# Altium project Ovladaci_karta.PrjPcb (part 2 of 2)

## Sheet PORT_SINGLE.SchDoc
size A4; SheetNumber: 8; SheetTotal: 8
Used 3 times, as channels U_PORTS_DRIVER/U_PORT_SINGLE, U_PORTS_DRIVER/U_PORT_SINGLE, U_PORTS_DRIVER/U_PORT_SINGLE. Parts and nets are listed once, with the designators drawn on the sheet.
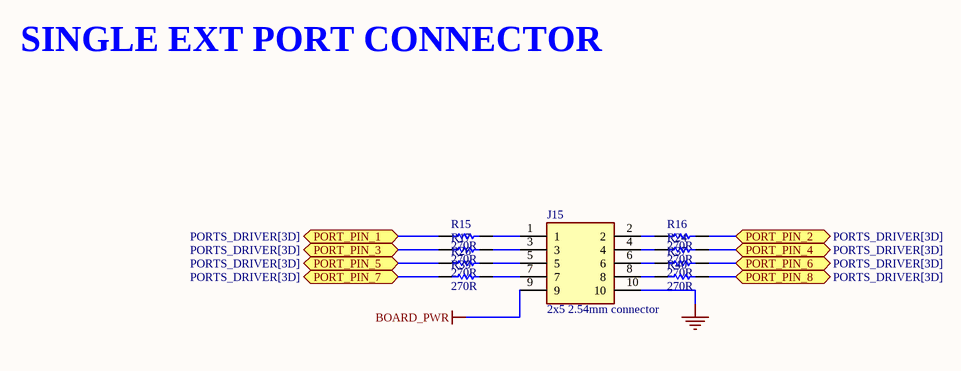
[diagram p9: PORT_SINGLE.SchDoc]

### Parts
J15  2x5 2.54mm connector  [SHDR10W64P254_2X5_2032X910X935P]
R15  270R  [RESC1005X40X25NL05T05]
R16  270R  [RESC1005X40X25NL05T05]
R17  270R  [RESC1005X40X25NL05T05]
R24  270R  [RESC1005X40X25NL05T05]
R26  270R  [RESC1005X40X25NL05T05]
R37  270R  [RESC1005X40X25NL05T05]
R39  270R  [RESC1005X40X25NL05T05]
R40  270R  [RESC1005X40X25NL05T05]

### Ports
PORT_PIN_1 (bidir, see PORTS_DRIVER[3D]), PORT_PIN_2 (bidir, see PORTS_DRIVER[3D]), PORT_PIN_3 (bidir, see PORTS_DRIVER[3D]), PORT_PIN_4 (bidir, see PORTS_DRIVER[3D]), PORT_PIN_5 (bidir, see PORTS_DRIVER[3D]), PORT_PIN_6 (bidir, see PORTS_DRIVER[3D]), PORT_PIN_7 (bidir, see PORTS_DRIVER[3D]), PORT_PIN_8 (bidir, see PORTS_DRIVER[3D])

### Nets
BOARD_PWR: J15.9
GND: J15.10
PORT_PIN_1: R15.2 ; port PORT_PIN_1
PORT_PIN_2: R16.1 ; port PORT_PIN_2
PORT_PIN_3: R17.2 ; port PORT_PIN_3
PORT_PIN_4: R24.1 ; port PORT_PIN_4
PORT_PIN_5: R26.2 ; port PORT_PIN_5
PORT_PIN_6: R37.1 ; port PORT_PIN_6
PORT_PIN_7: R39.2 ; port PORT_PIN_7
PORT_PIN_8: R40.1 ; port PORT_PIN_8
NetJ15_1: J15.1 R15.1
NetJ15_2: J15.2 R16.2
NetJ15_3: J15.3 R17.1
NetJ15_4: J15.4 R24.2
NetJ15_5: J15.5 R26.1
NetJ15_6: J15.6 R37.2
NetJ15_7: J15.7 R39.1
NetJ15_8: J15.8 R40.2

### Channels
U_PORTS_DRIVER/U_PORT_SINGLE: designators end in _U_PORTS_DRIVER_U_PORT_SINGLE#1; ports PORT_PIN_1=NetR15_U_PORTS_DRIVER_U_PORT_SINGLE#1_2 PORT_PIN_2=NetR16_U_PORTS_DRIVER_U_PORT_SINGLE#1_1 PORT_PIN_3=NetR17_U_PORTS_DRIVER_U_PORT_SINGLE#1_2 PORT_PIN_4=NetR24_U_PORTS_DRIVER_U_PORT_SINGLE#1_1 PORT_PIN_5=NetR26_U_PORTS_DRIVER_U_PORT_SINGLE#1_2 PORT_PIN_6=NetR37_U_PORTS_DRIVER_U_PORT_SINGLE#1_1 PORT_PIN_7=NetR39_U_PORTS_DRIVER_U_PORT_SINGLE#1_2 PORT_PIN_8=NetR40_U_PORTS_DRIVER_U_PORT_SINGLE#1_1
U_PORTS_DRIVER/U_PORT_SINGLE: designators end in _U_PORTS_DRIVER_U_PORT_SINGLE#2; ports PORT_PIN_1=NetR15_U_PORTS_DRIVER_U_PORT_SINGLE#2_2 PORT_PIN_2=NetR16_U_PORTS_DRIVER_U_PORT_SINGLE#2_1 PORT_PIN_3=NetR17_U_PORTS_DRIVER_U_PORT_SINGLE#2_2 PORT_PIN_4=NetR24_U_PORTS_DRIVER_U_PORT_SINGLE#2_1 PORT_PIN_5=NetR26_U_PORTS_DRIVER_U_PORT_SINGLE#2_2 PORT_PIN_6=NetR37_U_PORTS_DRIVER_U_PORT_SINGLE#2_1 PORT_PIN_7=NetR39_U_PORTS_DRIVER_U_PORT_SINGLE#2_2 PORT_PIN_8=NetR40_U_PORTS_DRIVER_U_PORT_SINGLE#2_1
U_PORTS_DRIVER/U_PORT_SINGLE: designators end in _U_PORTS_DRIVER_U_PORT_SINGLE#3; ports PORT_PIN_1=NetR15_U_PORTS_DRIVER_U_PORT_SINGLE#3_2 PORT_PIN_2=NetR16_U_PORTS_DRIVER_U_PORT_SINGLE#3_1 PORT_PIN_3=NetR17_U_PORTS_DRIVER_U_PORT_SINGLE#3_2 PORT_PIN_4=NetR24_U_PORTS_DRIVER_U_PORT_SINGLE#3_1 PORT_PIN_5=NetR26_U_PORTS_DRIVER_U_PORT_SINGLE#3_2 PORT_PIN_6=NetR37_U_PORTS_DRIVER_U_PORT_SINGLE#3_1 PORT_PIN_7=NetR39_U_PORTS_DRIVER_U_PORT_SINGLE#3_2 PORT_PIN_8=NetR40_U_PORTS_DRIVER_U_PORT_SINGLE#3_1

### Notes on the sheet
- SINGLE EXT PORT CONNECTOR

### Library data of the parts
J15 = connector - 5x2 -  2.54x2.54mm: 2x5position -  2.54x2.54mm connector; PartNumber: G821EU210AAL10Y; ComponentLink1Description: myLinks; ComponentLink1URL: https://cz.mouser.com/ProductDetail/Amphenol-Commercial-Products/G821EU210AAL10Y?qs=f9yNj16SXrKgfgt6Mg6Piw%3D%3D; Value: 2x5position -  2.54x2.54mm connector; Package: 2x5position -  2.54x2.54mm connector; Supplier 1: Mouser; Supplier Part Number 1: 523-G821EU210AAL10Y
R15-R17 R24 R26 R37 R39 R40 = Resistor - 0402 -270R: Resistor - 0402 - 270R - 1% - 125mW; PartNumber: CRGP0402F270R; Value: 270R; Package: 0402; ComponentLink1Description: myLinks; ComponentLink1URL: https://cz.mouser.com/ProductDetail/TE-Connectivity-Holsworthy/CRGP0402F270R?qs=wUXugUrL1qyX8E%252BNg7WV%252Bg%3D%3D; Supplier 1: Mouser; Supplier Part Number 1: 279-CRGP0402F270R

## Sheet Opto_outputs.SchDoc
size A4; SheetNumber: 6; SheetTotal: 8
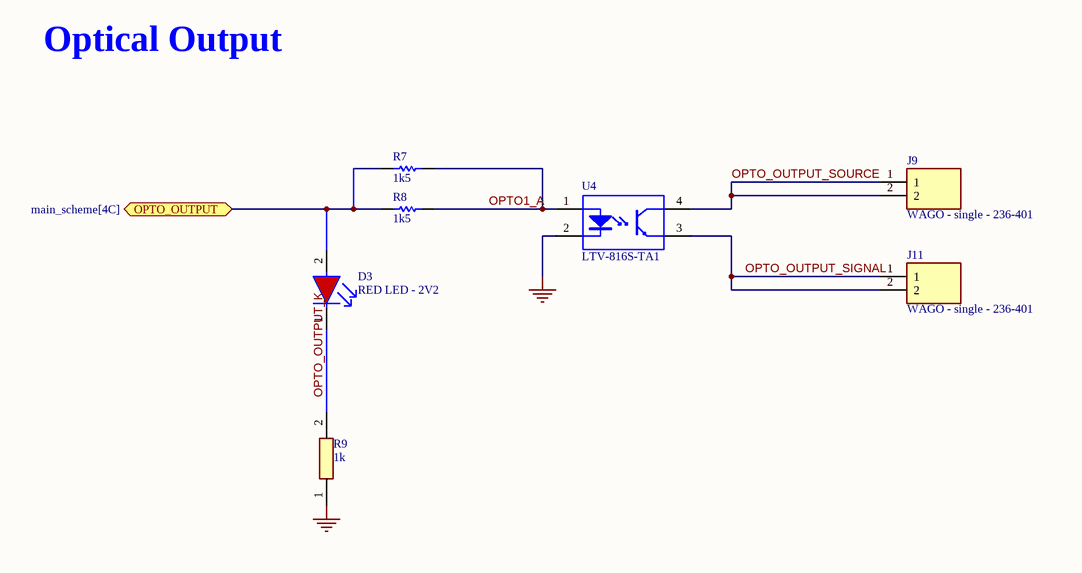
[diagram p10: Opto_outputs.SchDoc]

### Parts
D3  RED LED - 2V2  [0603_RED_LED]
J9  WAGO - single - 236-401  [WAGO-236-601]
J11  WAGO - single - 236-401  [WAGO-236-601]
R7  1k5  [RESC1005X40X25NL05T05]
R8  1k5  [RESC1005X40X25NL05T05]
R9  1k  [0603- SMD resistor]
U4  LTV-816S-TA1  [LTST-LTV-816S_V]

### Ports
OPTO_OUTPUT (bidir, see main_scheme[4C])

### Nets
GND: R9.1 U4.2(CATHODE)
OPTO1_A: R7.2 R8.2 U4.1(ANODE)
OPTO_OUTPUT: D3.2(A) R7.1 R8.1 ; port OPTO_OUTPUT
OPTO_OUTPUT_K: D3.1(C) R9.2
OPTO_OUTPUT_SIGNAL: J11.1 J11.2 U4.3(EMITTER)
OPTO_OUTPUT_SOURCE: J9.1 J9.2 U4.4(COLLECTOR)

### Notes on the sheet
- Optical Output

### Library data of the parts
D3 = LED - 0603 - RED - 2V2: LED RED DIFFUSED 0603 SMD; PartNumber: SML-D12U1WT86; Value: RED LED - 2.2V; Package: 0602; ComponentLink1Description: myLinks; ComponentLink1URL: https://cz.mouser.com/ProductDetail/ROHM-Semiconductor/SML-D12U1WT86?qs=M3jcYzEJUdEySuGkbjHEtQ%3D%3D; Supplier 1: Mouser; Supplier Part Number 1: 755-SML-D12U1WT86
J9 J11 = WAGO - single - 236-401: Wago connector - PCB to wire - single - 24A 320V; ComponentLink1Description: myLinks; ComponentLink1URL: https://cz.farnell.com/wago/236-401/terminal-block-wire-to-brd-1pos/dp/1891620?gclid=CjwKCAiAu5agBhBzEiwAdiR5tFj9uwuLgrlShO914YuSUEtsU0o4Hiox7ZjRnpSnFBbtyRYLbKYJWxoC0xgQAvD_BwE&mckv=sEoohdYPd_dc|pcrid|263733373421|kword|+wago%20+236-401|match|b|plid||slid||product||pgrid|56870816529|ptaid|kwd-298399736559|&CMP=KNC-GCZ-GEN-SKU-MDC; Value: 24A 320V; Package: 236-401; PartNumber: 236-401; Supplier 1: Farnell; Supplier Part Number 1: 1891620
R7 R8 = Resistor - 0402 - 1k5: Resistor - 0402 - 1k5 - 1% - 100mW; PartNumber: ERJ-2RKF1501X; Value: 1k5; Package: 0402; ComponentLink1Description: myLinks; ComponentLink1URL: https://cz.mouser.com/ProductDetail/Panasonic/ERJ-2RKF1501X?qs=sGAEpiMZZMtG0KNrPCHnjTg0x5DoQJ5PTwSSYoQ29R0%3D; Supplier 1: Mouser; Supplier Part Number 1: 667-ERJ-2RKF1501X
R9 = RESISTOR - 0603 - 1k: Resistor 0603 1KR 100mW 1%; PartNumber: RT0603FRE071KL; ComponentLink1Description: myLinks; ComponentLink1URL: https://cz.mouser.com/ProductDetail/YAGEO/RT0603FRE071KL?qs=8cPjvKtxWv68ZVEzoi6JxQ%3D%3D; Value: 1k; Package: 0603; Supplier 1: Mouser; Supplier Part Number 1: 603-RT0603FRE071KL
U4 = OPTO - 50mA - 80V: Photocoupler, 50 mA, -30 to 110 degC, 4-Pin SMD, RoHS, Tape and Reel; Value: output 80V 50mA, Input  1.2V; ComponentLink1Description: myLinks; ComponentLink1URL: https://cz.mouser.com/ProductDetail/Lite-On/LTV-816S-TA1?qs=gnaPJ2cis715Sm%2FgFsy6%2FQ%3D%3D; PartNumber: LTV-816S-TA1; Package: PDIP-4 Gull Wing; Supplier 1: Mouser; Supplier Part Number 1: 859-LTV-816S-TA1

## Nets that join several sheets
3V3_MCU: main_scheme (43 pins), POWER (6 pins), Ethernet (20 pins), U_Opto_inputs (U3_U_Opto_inputs#1.4), U_Opto_inputs (U3_U_Opto_inputs#2.4), U_Opto_inputs (U3_U_Opto_inputs#3.4), U_Opto_inputs (U3_U_Opto_inputs#4.4), U_Opto_inputs (U3_U_Opto_inputs#5.4), U_Opto_inputs (U3_U_Opto_inputs#6.4), U_Opto_inputs (U3_U_Opto_inputs#7.4), U_Opto_inputs (U3_U_Opto_inputs#8.4)
5V: main_scheme (J19.1 J19.2 P11.3), POWER (5 pins), PORTS_DRIVER (6 pins)
BOARD_PWR: main_scheme (6 pins), POWER (8 pins), U_PORTS_DRIVER/U_PORT_SINGLE (J15_U_PORTS_DRIVER_U_PORT_SINGLE#1.9), U_PORTS_DRIVER/U_PORT_SINGLE (J15_U_PORTS_DRIVER_U_PORT_SINGLE#2.9), U_PORTS_DRIVER/U_PORT_SINGLE (J15_U_PORTS_DRIVER_U_PORT_SINGLE#3.9)
GND: main_scheme (67 pins), POWER (16 pins), Ethernet (21 pins), USB (11 pins), U_Opto_inputs (D1_U_Opto_inputs#1.1), U_Opto_inputs (D1_U_Opto_inputs#2.1), U_Opto_inputs (D1_U_Opto_inputs#3.1), U_Opto_inputs (D1_U_Opto_inputs#4.1), U_Opto_inputs (D1_U_Opto_inputs#5.1), U_Opto_inputs (D1_U_Opto_inputs#6.1), U_Opto_inputs (D1_U_Opto_inputs#7.1), U_Opto_inputs (D1_U_Opto_inputs#8.1), PORTS_DRIVER (6 pins), U_PORTS_DRIVER/U_PORT_SINGLE (J15_U_PORTS_DRIVER_U_PORT_SINGLE#1.10), U_PORTS_DRIVER/U_PORT_SINGLE (J15_U_PORTS_DRIVER_U_PORT_SINGLE#2.10), U_PORTS_DRIVER/U_PORT_SINGLE (J15_U_PORTS_DRIVER_U_PORT_SINGLE#3.10), Opto_outputs (R9.1 U4.2)
NetR6_U_Opto_inputs#1_2: main_scheme (U7.13), U_Opto_inputs (R6_U_Opto_inputs#1.2 U3_U_Opto_inputs#1.3)
NetR6_U_Opto_inputs#2_2: main_scheme (U7.14), U_Opto_inputs (R6_U_Opto_inputs#2.2 U3_U_Opto_inputs#2.3)
NetR6_U_Opto_inputs#3_2: main_scheme (U7.15), U_Opto_inputs (R6_U_Opto_inputs#3.2 U3_U_Opto_inputs#3.3)
NetR6_U_Opto_inputs#4_2: main_scheme (U7.12), U_Opto_inputs (R6_U_Opto_inputs#4.2 U3_U_Opto_inputs#4.3)
NetR6_U_Opto_inputs#5_2: main_scheme (U7.1), U_Opto_inputs (R6_U_Opto_inputs#5.2 U3_U_Opto_inputs#5.3)
NetR6_U_Opto_inputs#6_2: main_scheme (U7.5), U_Opto_inputs (R6_U_Opto_inputs#6.2 U3_U_Opto_inputs#6.3)
NetR6_U_Opto_inputs#7_2: main_scheme (U7.2), U_Opto_inputs (R6_U_Opto_inputs#7.2 U3_U_Opto_inputs#7.3)
NetR6_U_Opto_inputs#8_2: main_scheme (U7.4), U_Opto_inputs (R6_U_Opto_inputs#8.2 U3_U_Opto_inputs#8.3)
NetR15_U_PORTS_DRIVER_U_PORT_SINGLE#1_2: PORTS_DRIVER (U9.15), U_PORTS_DRIVER/U_PORT_SINGLE (R15_U_PORTS_DRIVER_U_PORT_SINGLE#1.2)
NetR15_U_PORTS_DRIVER_U_PORT_SINGLE#2_2: PORTS_DRIVER (U10.15), U_PORTS_DRIVER/U_PORT_SINGLE (R15_U_PORTS_DRIVER_U_PORT_SINGLE#2.2)
NetR15_U_PORTS_DRIVER_U_PORT_SINGLE#3_2: PORTS_DRIVER (U11.15), U_PORTS_DRIVER/U_PORT_SINGLE (R15_U_PORTS_DRIVER_U_PORT_SINGLE#3.2)
NetR16_U_PORTS_DRIVER_U_PORT_SINGLE#1_1: PORTS_DRIVER (U9.1), U_PORTS_DRIVER/U_PORT_SINGLE (R16_U_PORTS_DRIVER_U_PORT_SINGLE#1.1)
NetR16_U_PORTS_DRIVER_U_PORT_SINGLE#2_1: PORTS_DRIVER (U10.1), U_PORTS_DRIVER/U_PORT_SINGLE (R16_U_PORTS_DRIVER_U_PORT_SINGLE#2.1)
NetR16_U_PORTS_DRIVER_U_PORT_SINGLE#3_1: PORTS_DRIVER (U11.1), U_PORTS_DRIVER/U_PORT_SINGLE (R16_U_PORTS_DRIVER_U_PORT_SINGLE#3.1)
NetR17_U_PORTS_DRIVER_U_PORT_SINGLE#1_2: PORTS_DRIVER (U9.2), U_PORTS_DRIVER/U_PORT_SINGLE (R17_U_PORTS_DRIVER_U_PORT_SINGLE#1.2)
NetR17_U_PORTS_DRIVER_U_PORT_SINGLE#2_2: PORTS_DRIVER (U10.2), U_PORTS_DRIVER/U_PORT_SINGLE (R17_U_PORTS_DRIVER_U_PORT_SINGLE#2.2)
NetR17_U_PORTS_DRIVER_U_PORT_SINGLE#3_2: PORTS_DRIVER (U11.2), U_PORTS_DRIVER/U_PORT_SINGLE (R17_U_PORTS_DRIVER_U_PORT_SINGLE#3.2)
NetR24_U_PORTS_DRIVER_U_PORT_SINGLE#1_1: PORTS_DRIVER (U9.3), U_PORTS_DRIVER/U_PORT_SINGLE (R24_U_PORTS_DRIVER_U_PORT_SINGLE#1.1)
NetR24_U_PORTS_DRIVER_U_PORT_SINGLE#2_1: PORTS_DRIVER (U10.3), U_PORTS_DRIVER/U_PORT_SINGLE (R24_U_PORTS_DRIVER_U_PORT_SINGLE#2.1)
NetR24_U_PORTS_DRIVER_U_PORT_SINGLE#3_1: PORTS_DRIVER (U11.3), U_PORTS_DRIVER/U_PORT_SINGLE (R24_U_PORTS_DRIVER_U_PORT_SINGLE#3.1)
NetR26_U_PORTS_DRIVER_U_PORT_SINGLE#1_2: PORTS_DRIVER (U9.4), U_PORTS_DRIVER/U_PORT_SINGLE (R26_U_PORTS_DRIVER_U_PORT_SINGLE#1.2)
NetR26_U_PORTS_DRIVER_U_PORT_SINGLE#2_2: PORTS_DRIVER (U10.4), U_PORTS_DRIVER/U_PORT_SINGLE (R26_U_PORTS_DRIVER_U_PORT_SINGLE#2.2)
NetR26_U_PORTS_DRIVER_U_PORT_SINGLE#3_2: PORTS_DRIVER (U11.4), U_PORTS_DRIVER/U_PORT_SINGLE (R26_U_PORTS_DRIVER_U_PORT_SINGLE#3.2)
NetR37_U_PORTS_DRIVER_U_PORT_SINGLE#1_1: PORTS_DRIVER (U9.5), U_PORTS_DRIVER/U_PORT_SINGLE (R37_U_PORTS_DRIVER_U_PORT_SINGLE#1.1)
NetR37_U_PORTS_DRIVER_U_PORT_SINGLE#2_1: PORTS_DRIVER (U10.5), U_PORTS_DRIVER/U_PORT_SINGLE (R37_U_PORTS_DRIVER_U_PORT_SINGLE#2.1)
NetR37_U_PORTS_DRIVER_U_PORT_SINGLE#3_1: PORTS_DRIVER (U11.5), U_PORTS_DRIVER/U_PORT_SINGLE (R37_U_PORTS_DRIVER_U_PORT_SINGLE#3.1)
NetR39_U_PORTS_DRIVER_U_PORT_SINGLE#1_2: PORTS_DRIVER (U9.6), U_PORTS_DRIVER/U_PORT_SINGLE (R39_U_PORTS_DRIVER_U_PORT_SINGLE#1.2)
NetR39_U_PORTS_DRIVER_U_PORT_SINGLE#2_2: PORTS_DRIVER (U10.6), U_PORTS_DRIVER/U_PORT_SINGLE (R39_U_PORTS_DRIVER_U_PORT_SINGLE#2.2)
NetR39_U_PORTS_DRIVER_U_PORT_SINGLE#3_2: PORTS_DRIVER (U11.6), U_PORTS_DRIVER/U_PORT_SINGLE (R39_U_PORTS_DRIVER_U_PORT_SINGLE#3.2)
NetR40_U_PORTS_DRIVER_U_PORT_SINGLE#1_1: PORTS_DRIVER (U9.7), U_PORTS_DRIVER/U_PORT_SINGLE (R40_U_PORTS_DRIVER_U_PORT_SINGLE#1.1)
NetR40_U_PORTS_DRIVER_U_PORT_SINGLE#2_1: PORTS_DRIVER (U10.7), U_PORTS_DRIVER/U_PORT_SINGLE (R40_U_PORTS_DRIVER_U_PORT_SINGLE#2.1)
NetR40_U_PORTS_DRIVER_U_PORT_SINGLE#3_1: PORTS_DRIVER (U11.7), U_PORTS_DRIVER/U_PORT_SINGLE (R40_U_PORTS_DRIVER_U_PORT_SINGLE#3.1)
OPTO_OUTPUT: main_scheme (U1.50), Opto_outputs (D3.2 R7.1 R8.1)
PORTS_OE: main_scheme (U1.2), PORTS_DRIVER (U9.13 U10.13 U11.13)
PORTS_RCLK: main_scheme (U1.3), PORTS_DRIVER (U9.12 U10.12 U11.12)
PORTS_SER: main_scheme (U1.1), PORTS_DRIVER (U9.14)
PORTS_SRCLK: main_scheme (U1.4), PORTS_DRIVER (U9.11 U10.11 U11.11)
PORTS_SRCLR: main_scheme (U1.5), PORTS_DRIVER (U9.10 U10.10 U11.10)
RMII_CRS_DV_PA7: main_scheme (U1.43), Ethernet (R27.2 U5.33)
RMII_MDC_PC1: main_scheme (U1.27), Ethernet (U5.25)
RMII_MDIO_PA2: main_scheme (U1.36), Ethernet (R29.2 U5.24)
RMII_REF_CLK_PA1: main_scheme (U1.35), Ethernet (U5.28 Y2.3)
RMII_RXD_0_PC4: main_scheme (U1.44), Ethernet (U5.36)
RMII_RXD_1_PC5: main_scheme (U1.45), Ethernet (U5.37)
RMII_TX_EN_PB11: main_scheme (U1.70), Ethernet (U5.3)
RMII_TXD_0_PB12: main_scheme (U1.73), Ethernet (U5.4)
RMII_TXD_1_PB_13: main_scheme (U1.74), Ethernet (U5.5)
USB_5V: main_scheme (P8.3), USB (C38.1 D6.2 FB1.2 R35.1)
USB_D_N: main_scheme (U1.103), USB (D7.4 J6.3)
USB_D_P: main_scheme (U1.104), USB (D7.3 J6.4)
USB_ID: main_scheme (U1.102), USB (D7.1 J6.5)
USB_SENSE: main_scheme (U1.101), USB (R35.2 R38.1)
V_ref_analog: main_scheme (U1.32), POWER (C25.1 C26.1 L1.2)

## Assembly variants
FullyAssembled: all parts fitted
AssembledForTester: not fitted D3 R9 R48 R50